# Altium schematic sheet LEDs.SchDoc: =DocumentName
size A4; DocumentNumber: 1; Revision: 0; SheetNumber: 5; SheetTotal: 20
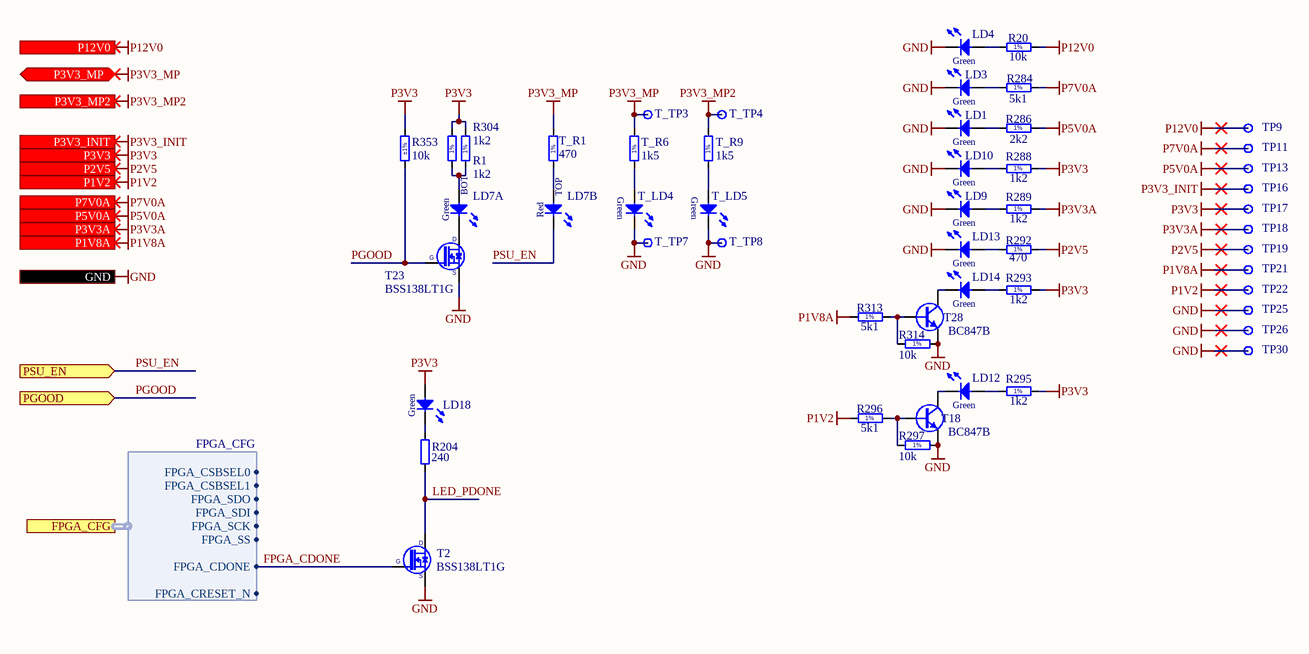
[diagram p0: LEDs.SchDoc]

## Parts
LD1  Green  [LED_KINGBRIGHT_KPH-1608CGCK]
LD3  Green  [LED_KINGBRIGHT_KPH-1608CGCK]
LD4  Green  [LED_KINGBRIGHT_KPH-1608CGCK]
LD7  Red/Green  [LED_DIALIGHT_571-0112F]  (value not drawn)  (parts A,B of 2)
LD9  Green  [LED_KINGBRIGHT_KPH-1608CGCK]
LD10  Green  [LED_KINGBRIGHT_KPH-1608CGCK]
LD12  Green  [LED_KINGBRIGHT_KPH-1608CGCK]
LD13  Green  [LED_KINGBRIGHT_KPH-1608CGCK]
LD14  Green  [LED_KINGBRIGHT_KPH-1608CGCK]
LD18  Green  [LED_AVAGO_HSME-C120]
R1  1k2  [RESC1608X55N]
R20  10k  [RESC1005X40N]
R204  240  [RESC1005X40N]
R284  5k1  [RESC1005X40N]
R286  2k2  [RESC1005X40N]
R288  1k2  [RESC1608X55N]
R289  1k2  [RESC1608X55N]
R292  470  [RESC1005X40N]
R293  1k2  [RESC1608X55N]
R295  1k2  [RESC1608X55N]
R296  5k1  [RESC1005X40N]
R297  10k  [RESC1005X40N]
R304  1k2  [RESC1608X55N]
R313  5k1  [RESC1005X40N]
R314  10k  [RESC1005X40N]
R353  10k  Tolerance: ±1%  [RESC1005X40N]
T2  BSS138LT1G  [SOT95P240X110-3N]
T18  BC847B  [SOT95P230X110-3N]
T23  BSS138LT1G  [SOT95P240X110-3N]
T28  BC847B  [SOT95P230X110-3N]
T_LD4  Green  [LED_KINGBRIGHT_KPH-1608CGCK]  (value not drawn)
T_LD5  Green  [LED_KINGBRIGHT_KPH-1608CGCK]  (value not drawn)
T_R1  470  [RESC1005X40N]
T_R6  1k5  [RESC1608X55N]
T_R9  1k5  [RESC1608X55N]
T_TP3  Test Point  [TPS127]  (value not drawn)  (no BOM)
T_TP4  Test Point  [TPS127]  (value not drawn)  (no BOM)
T_TP7  Test Point  [TPS127]  (value not drawn)  (no BOM)
T_TP8  Test Point  [TPS127]  (value not drawn)  (no BOM)
TP9  Test Point  [TPS127]  (value not drawn)  (no BOM)
TP11  Test Point  [TPS127]  (value not drawn)  (no BOM)
TP13  Test Point  [TPS127]  (value not drawn)  (no BOM)
TP16  Test Point  [TPS127]  (value not drawn)  (no BOM)
TP17  Test Point  [TPS127]  (value not drawn)  (no BOM)
TP18  Test Point  [TPS127]  (value not drawn)  (no BOM)
TP19  Test Point  [TPS127]  (value not drawn)  (no BOM)
TP21  Test Point  [TPS127]  (value not drawn)  (no BOM)
TP22  Test Point  [TPS127]  (value not drawn)  (no BOM)
TP25  Test Point  [TPS127]  (value not drawn)  (no BOM)
TP26  Test Point  [TPS127]  (value not drawn)  (no BOM)
TP30  Test Point  [TPS127]  (value not drawn)  (no BOM)

## Ports
FPGA_CFG (harness FPGA_CFG), GND, P1V2 (out), P1V8A (out), P2V5 (out), P3V3 (out), P3V3_INIT (out), P3V3_MP2 (in), P3V3_MP (bidir), P3V3A (out), P5V0A (out), P7V0A (out), P12V0 (in), PGOOD (in), PSU_EN (in)

## Harnesses
FPGA_CFG: FPGA_CSBSEL0, FPGA_CSBSEL1, FPGA_SDO, FPGA_SDI, FPGA_SCK, FPGA_SS, FPGA_CDONE, FPGA_CRESET_N

## Nets
GND: LD1.1(C) LD3.1(C) LD4.1(C) LD9.1(C) LD10.1(C) LD13.1(C) R297.2 R314.2 T2.2(S) T18.2(E) T23.2(S) T28.2(E) T_LD4.1(C) T_LD5.1(C) T_TP7.1 T_TP8.1 TP25.1 TP26.1 TP30.1 ; port GND
P1V2: R296.1 TP22.1 ; port P1V2
P1V8A: R313.1 TP21.1 ; port P1V8A
P2V5: R292.1 TP19.1 ; port P2V5
P3V3: LD18.2(A) R1.2 R288.2 R293.2 R295.2 R304.2 R353.2 TP17.1 ; port P3V3
P3V3_INIT: TP16.1 ; port P3V3_INIT
P3V3_MP: T_R1.1 T_R6.2 T_TP3.1 ; port P3V3_MP
P3V3_MP2: T_R9.2 T_TP4.1 ; port P3V3_MP2
P3V3A: R289.2 TP18.1 ; port P3V3A
P5V0A: R286.2 TP13.1 ; port P5V0A
P7V0A: R284.2 TP11.1 ; port P7V0A
P12V0: R20.2 TP9.1 ; port P12V0
FPGA_CDONE: T2.1(G) ; port FPGA_CFG.FPGA_CDONE
LED_PDONE: R204.1 T2.3(D)
PGOOD: R353.1 T23.1(G) ; port PGOOD
PSU_EN: LD7.3(C) ; port PSU_EN
NetLD1_2: LD1.2(A) R286.1
NetLD3_2: LD3.2(A) R284.1
NetLD4_2: LD4.2(A) R20.1
NetLD7_1: LD7.1(C) T23.3(D)
NetLD7_2: LD7.2(A) R1.1 R304.1
NetLD7_4: LD7.4(A) T_R1.2
NetLD9_2: LD9.2(A) R289.1
NetLD10_2: LD10.2(A) R288.1
NetLD12_1: LD12.1(C) T18.3(C)
NetLD12_2: LD12.2(A) R295.1
NetLD13_2: LD13.2(A) R292.2
NetLD14_1: LD14.1(C) T28.3(C)
NetLD14_2: LD14.2(A) R293.1
NetLD18_1: LD18.1(C) R204.2
NetR296_2: R296.2 R297.1 T18.1(B)
NetR313_2: R313.2 R314.1 T28.1(B)
NetT_LD4_2: T_LD4.2(A) T_R6.1
NetT_LD5_2: T_LD5.2(A) T_R9.1

## Notes on the sheet
- Filename:
- Project:
- SINARA
  LOGO
  TBD
- Originally released by:
- Last modified by:
- Last reviewed by:
- Size:
- Version:
- Last mod. date :
- Sheet:
- A4
- Copyright =P_copyright_owner
  This source describes Open Hardware and is licensed under the CERN-OHL-W v1. You may redistribute and modify this documentation and make products using it under the terms of the CERN-OHL-W v1 (https:/cern.ch/cern-ohl). This documentation is distributed WITHOUT ANY EXPRESS OR IMPLIED WARRANTY, INCLUDING OF MERCHANTABILITY, SATISFACTORY QUALITY AND FITNESS FOR A PARTICULAR PURPOSE. Please see the CERN-OHL-W v1 for applicable conditions.
  As per CERN-OHL-W 1 section 4.1, should You produce hardware based on these sources, You must maintain the Source Location visible on the external case of the product you make using this documentation.
  Source location: =P_github_link
- Sinara Opern Hardware:
- https://github.com/sinara-hw
- (in symbol LED_DIALIGHT_571-0112F, part A) BOT; Green
- (in symbol LED_DIALIGHT_571-0112F, part B) TOP; Red
- (in symbol R0402_2K2_1%_0.0625W_100PPM) 1%
- (in symbol R0402_5K1_1%_0.0625W_100PPM) 1%
- (in symbol R0402_10K_1%_0.0625W_100PPM) 1%
- (in symbol R0402_470R_1%_0.0625W_100PPM) 1%
- (in symbol R0603_1K2_1%_0.1W_100PPM) 1%
- (in symbol R0603_1K5_1%_0.1W_100PPM) 1%

## Library data of the parts
LD1 LD3 LD4 LD9 LD10 LD12-LD14 T_LD4 T_LD5 = LED_KINGBRIGHT_KPH-1608CGCK: LED Green 1C 2A; Part Description: SMD Green LED, Case 1.6mmX0.8mm(0603), 0.65mm Thickness; PressFit: No; Bonding: No; Part Number: LED_KINGBRIGHT_KPH-1608CGCK; Component Kind: Standard; Component Type: Standard; Color: Green; PackageDescription: SMT Green LED, Case 0603, Body L 1.6 x W 0.8mm H 0.65mm; Manufacturer: KINGBRIGHT; Manufacturer Part Number: KPH-1608CGCK; Pin Count: 2; Mounted: Yes; Socket: No; SMD: Yes; Sense: No; ComponentHeight: 0.65mm; HelpURL: \\cern.ch\dfs\Applications\Altium\Datasheets\LED_KINGBRIGHT_KPH-1608CGCK.pdf; Author: CERN DEM JLC
  LD1 LD3 LD4 LD9 LD10 LD12-LD14: CreateDate: 03/07/2017; LatestRevisionDate: 03/07/2017
  T_LD4 T_LD5: CreateDate: 03.07.2017; LatestRevisionDate: 03.07.2017
LD7 = LED_DIALIGHT_571-0112F: 2x LED  Botom Green, Top Red; Part Description: Dual 2mm  LEDs, Red Top,Green Bot, CBI® Circuit Board Indicator (Without positioning pins); PressFit: No; Bonding: No; Part Number: LED_DIALIGHT_571-0112F; Component Kind: Standard; Component Type: Standard; Color: Red/Green; PackageDescription: 2x 2mm LED (Top: Red, Bot: Green) PCB Edge Mounting (Without positioning pins) DIALIGHT 571 Serie; Manufacturer: DIALIGHT; Manufacturer Part Number: 571-0112F; Pin Count: 4; Mounted: Yes; Socket: No; SMD: No; Sense: No; ComponentHeight: 8.6mm; HelpURL: \\cern.ch\dfs\Applications\Altium\Datasheets\LED_DIALIGHT_571-0112F.pdf; Author: CERN DEM JLC; CreateDate: 09.11.2009; LatestRevisionDate: 17.03.2010
LD18 = LED_AVAGO_HSME-C120: LED Green 1C 2A; Part Description: High Performance Right Angle Chip Green LED; Manufacturer: AVAGO TECHNOLOGIES; PressFit: No; Bonding: No; Part Number: LED_AVAGO_HSME-C120; Component Kind: Standard; Component Type: Standard; Color: Green; PackageDescription: Green Chip LED, 2-Leads, Body 1.7x1.1mm, Side Emitting Package; Manufacturer Part Number: HSME-C120; Pin Count: 2; Mounted: Yes; Socket: No; SMD: Yes; Sense: No; ComponentHeight: 0.7mm; HelpURL: \\cern.ch\dfs\Applications\Altium\Datasheets\LED_AVAGO_HSME-C120.pdf; ComponentLink1URL: \\cern.ch\dfs\Applications\Altium\Datasheets\LED_AVAGO_HSME-C110_DESIGN-GUIDE.pdf; ComponentLink1Description: Design Guide; Author: CERN DEM JMW; CreateDate: 22.07.2009; LatestRevisionDate: 20.06.2012
R1 R288 R289 R293 R295 R304 = R0603_1K2_1%_0.1W_100PPM: Resistor - 1%; Part Description: General Purpose Thick Film Chip Resistor; Manufacturer: GENERIC; Manufacturer1 Part Number: NRC06F1201TRF; Power: 0.1W; TC: ±100ppm/°C; Part Number: R0603_1K2_1%_0.1W_100PPM; Component Kind: Standard; Component Type: Standard; Pin Count: 2; Value: 1k2; Status: Preferred; Tolerance: ±1%; Manufacturer Part Number: R0603_1K2_1%_0.1W_100PPM; Case: 0603; Mounted: Yes; Sense: No; Socket: No; SMD: Yes; Manufacturer1 Example: NIC COMPONENT; Manufacturer1 ComponentHeight: 0.55mm; HelpURL: \\cern.ch\dfs\Applications\Altium\Datasheets\R0603_NIC_NRC.pdf; Author: CERN DEM JLC; CreateDate: 03.12.2007; LatestRevisionDate: 13.03.2008
R20 R297 R314 R353 = R0402_10K_1%_0.0625W_100PPM: Resistor - 1%; Part Description: General Purpose Thick Film Chip Resistor; Manufacturer: GENERIC; Manufacturer1 Part Number: 232270671003L; TC: ±100ppm/°C; PressFit: No; Part Number: R0402_10K_1%_0.0625W_100PPM; Component Kind: Standard; Component Type: Standard; Pin Count: 2; Value: 10k; Status: Not Recommended; Power: 0.0625W; Manufacturer Part Number: R0402_10K_1%_0.0625W_100PPM; Case: 0402; Mounted: Yes; Sense: No; Socket: No; SMD: Yes; Manufacturer1 Example: YAGEO PHYCOMP; Manufacturer1 ComponentHeight: 0.4mm; HelpURL: \\cern.ch\dfs\Applications\Altium\Datasheets\R0402_Phycomp_RC0402.pdf; Author: CERN DEM JLC; CreateDate: 03.12.2007; LatestRevisionDate: 17.10.2012
  R20 R297 R314: Tolerance: ±1%
R204 = R0402_240R_1%_0.0625W_100PPM: Resistor - 1%; Part Description: General Purpose Thick Film Chip Resistor; Manufacturer: GENERIC; Manufacturer1 Part Number: 232270672401L; TC: ±100ppm/°C; PressFit: No; Part Number: R0402_240R_1%_0.0625W_100PPM; Component Kind: Standard; Component Type: Standard; Pin Count: 2; Value: 240; Status: Not Recommended; Power: 0.0625W; Tolerance: ±1%; Manufacturer Part Number: R0402_240R_1%_0.0625W_100PPM; Case: 0402; Mounted: Yes; Sense: No; Socket: No; SMD: Yes; Manufacturer1 Example: YAGEO PHYCOMP; Manufacturer1 ComponentHeight: 0.4mm; HelpURL: \\cern.ch\dfs\Applications\Altium\Datasheets\R0402_Phycomp_RC0402.pdf; Author: CERN DEM JLC; CreateDate: 03.12.2007; LatestRevisionDate: 17.10.2012
R284 R296 R313 = R0402_5K1_1%_0.0625W_100PPM: Resistor - 1%; Part Description: General Purpose Thick Film Chip Resistor; Manufacturer: GENERIC; Manufacturer1 Part Number: 232270675102L; TC: ±100ppm/°C; PressFit: No; Part Number: R0402_5K1_1%_0.0625W_100PPM; Component Kind: Standard; Component Type: Standard; Pin Count: 2; Value: 5k1; Status: Not Recommended; Power: 0.0625W; Tolerance: ±1%; Manufacturer Part Number: R0402_5K1_1%_0.0625W_100PPM; Case: 0402; Mounted: Yes; Sense: No; Socket: No; SMD: Yes; Manufacturer1 Example: YAGEO PHYCOMP; Manufacturer1 ComponentHeight: 0.4mm; HelpURL: \\cern.ch\dfs\Applications\Altium\Datasheets\R0402_Phycomp_RC0402.pdf; Author: CERN DEM JLC; CreateDate: 03.12.2007; LatestRevisionDate: 17.10.2012
R286 = R0402_2K2_1%_0.0625W_100PPM: Resistor - 1%; Part Description: General Purpose Thick Film Chip Resistor; Manufacturer: GENERIC; Manufacturer1 Part Number: 232270672202L; TC: ±100ppm/°C; Table: Resistors SMD; Part Number: R0402_2K2_1%_0.0625W_100PPM; Component Kind: Standard; Component Type: Standard; Pin Count: 2; Value: 2k2; Status: Not recommended; Power: 0.0625W; Tolerance: ±1%; Manufacturer Part Number: R0402_2K2_1%_0.0625W_100PPM; Case: 0402; Mounted: Yes; Socket: No; SMD: Yes; Manufacturer1 Example: YAGEO PHYCOMP; Manufacturer1 ComponentHeight: 0.4mm; HelpURL: \\cern.ch\dfs\Applications\Altium\Datasheets\R0402_Phycomp_RC0402.pdf; Author: CERN DEM JLC; CreateDate: 2007-12-03; LatestRevisionDate: 2012-10-17
R292 T_R1 = R0402_470R_1%_0.0625W_100PPM: Resistor - 1%; Part Description: General Purpose Thick Film Chip Resistor; Manufacturer: GENERIC; Manufacturer1 Part Number: 232270674701L; TC: ±100ppm/°C; PressFit: No; Part Number: R0402_470R_1%_0.0625W_100PPM; Component Kind: Standard; Component Type: Standard; Pin Count: 2; Value: 470; Status: Not Recommended; Power: 0.0625W; Tolerance: ±1%; Manufacturer Part Number: R0402_470R_1%_0.0625W_100PPM; Case: 0402; Mounted: Yes; Sense: No; Socket: No; SMD: Yes; Manufacturer1 Example: YAGEO PHYCOMP; Manufacturer1 ComponentHeight: 0.4mm; HelpURL: \\cern.ch\dfs\Applications\Altium\Datasheets\R0402_Phycomp_RC0402.pdf; Author: CERN DEM JLC; CreateDate: 03.12.2007; LatestRevisionDate: 17.10.2012
T2 = BSS138LT1G: N-CHANNEL MOSFET WITH DIODE; Part Description: 50V 200mA N-Channel Enhancement Mode Field-Effect Transistor; Manufacturer: ON SEMICONDUCTOR; PressFit: No; Bonding: No; Part Number: BSS138LT1G; Component Kind: Standard; Component Type: Standard; Device: BSS138LT1G; PackageDescription: SOT23 3-Leads, Pitch 0.95mm - Body 1.4x3mm, IPC Medium Density; Manufacturer Part Number: BSS138LT1G; Pin Count: 3; Case: SOT23-3; Mounted: Yes; Socket: No; SMD: Yes; Sense: No; ComponentHeight: 1.11mm; HelpURL: \\cern.ch\dfs\Applications\Altium\Datasheets\BSS138LT1G.pdf; Author: CERN DEM JLC; CreateDate: 23.03.2009; LatestRevisionDate: 23.03.2009
T18 T28 = BC847B: NPN Transistor; Part Description: 45V 100mA NPN general-purpose transistors; Manufacturer: NXP SEMICONDUCTORS; PressFit: No; Bonding: No; Part Number: BC847B; Component Kind: Standard; Component Type: Standard; Device: BC847B; PackageDescription: SOT23, 3 pin, Pitch 0.95mm - 1.3mm W X 2.9mm L X 1.1mm H, IPC Medium Density; Manufacturer Part Number: BC847B; Pin Count: 3; Case: SOT23-3; Mounted: Yes; Socket: No; SMD: Yes; Sense: No; ComponentHeight: 1.1mm; HelpURL: \\cern.ch\dfs\Applications\Altium\Datasheets\BC847B.pdf; Author: CERN DEM JLC; CreateDate: 14.06.2011; LatestRevisionDate: 14.06.2011
T23 = BSS138LT1G: N-CHANNEL MOSFET WITH DIODE; Part Description: 50V, 200mA N-Channel Enhancement Mode Field-Effect Transistor; Manufacturer: ON SEMICONDUCTOR; PressFit: No; Bonding: No; Part Number: BSS138LT1G; Component Kind: Standard; Component Type: Standard; Device: BSS138LT1G; PackageDescription: SOT23, 0.95mm Pitch; 3 Pin, 1.40mm W X 3.00mm L X 1.10mm H body, IPC Medium Density; Manufacturer Part Number: BSS138L; Pin Count: 3; Case: SOT23-3; Mounted: Yes; Socket: No; SMD: Yes; Sense: No; ComponentHeight: 1.11mm; HelpURL: \\cern.ch\dfs\Applications\Altium\Datasheets\BSS138LT1G.pdf; Author: CERN DEM JLC; CreateDate: 23.03.2009; LatestRevisionDate: 25.05.2022
T_R6 T_R9 = R0603_1K5_1%_0.1W_100PPM: Resistor - 1%; Part Description: General Purpose Thick Film Chip Resistor; Manufacturer: GENERIC; Manufacturer1 Part Number: NRC06F1501TRF; Power: 0.1W; TC: ±100ppm/°C; PressFit: No; Part Number: R0603_1K5_1%_0.1W_100PPM; Component Kind: Standard; Component Type: Standard; Pin Count: 2; Value: 1k5; Status: Preferred; Tolerance: ±1%; Manufacturer Part Number: R0603_1K5_1%_0.1W_100PPM; Case: 0603; Mounted: Yes; Sense: No; Socket: No; SMD: Yes; Manufacturer1 Example: NIC COMPONENT; Manufacturer1 ComponentHeight: 0.55mm; HelpURL: \\cern.ch\dfs\Applications\Altium\Datasheets\R0603_NIC_NRC.pdf; Author: CERN DEM JLC; CreateDate: 03.12.2007; LatestRevisionDate: 13.03.2008
T_TP3 T_TP4 T_TP7 T_TP8 TP9 TP11 TP13 TP16-TP19 TP21 TP22 TP25 TP26 TP30 = SMD_PAD_1.27X1.27MM: Part Description: 1.27mm x 1.27mm PCB Copper Area (SMD Test Point); Mounted: No; Part Number: SMD_PAD_1.27X1.27MM; Component Type: Standard (No BOM); Pin Count: 1; Family: Test Point; Socket: No; SMD: Yes; Sense: No; Status: None; ComponentHeight: 0mm; HelpURL: Undefined; Author: CERN DEM JLC; CreateDate: 12.01.2008; LatestRevisionDate: 12.01.2008; PackageDescription: 1.27mm x 1.27mm PCB Copper Area (SMD Test Point)